# Altium schematic sheet nlf15-main_power.SchDoc
size A4
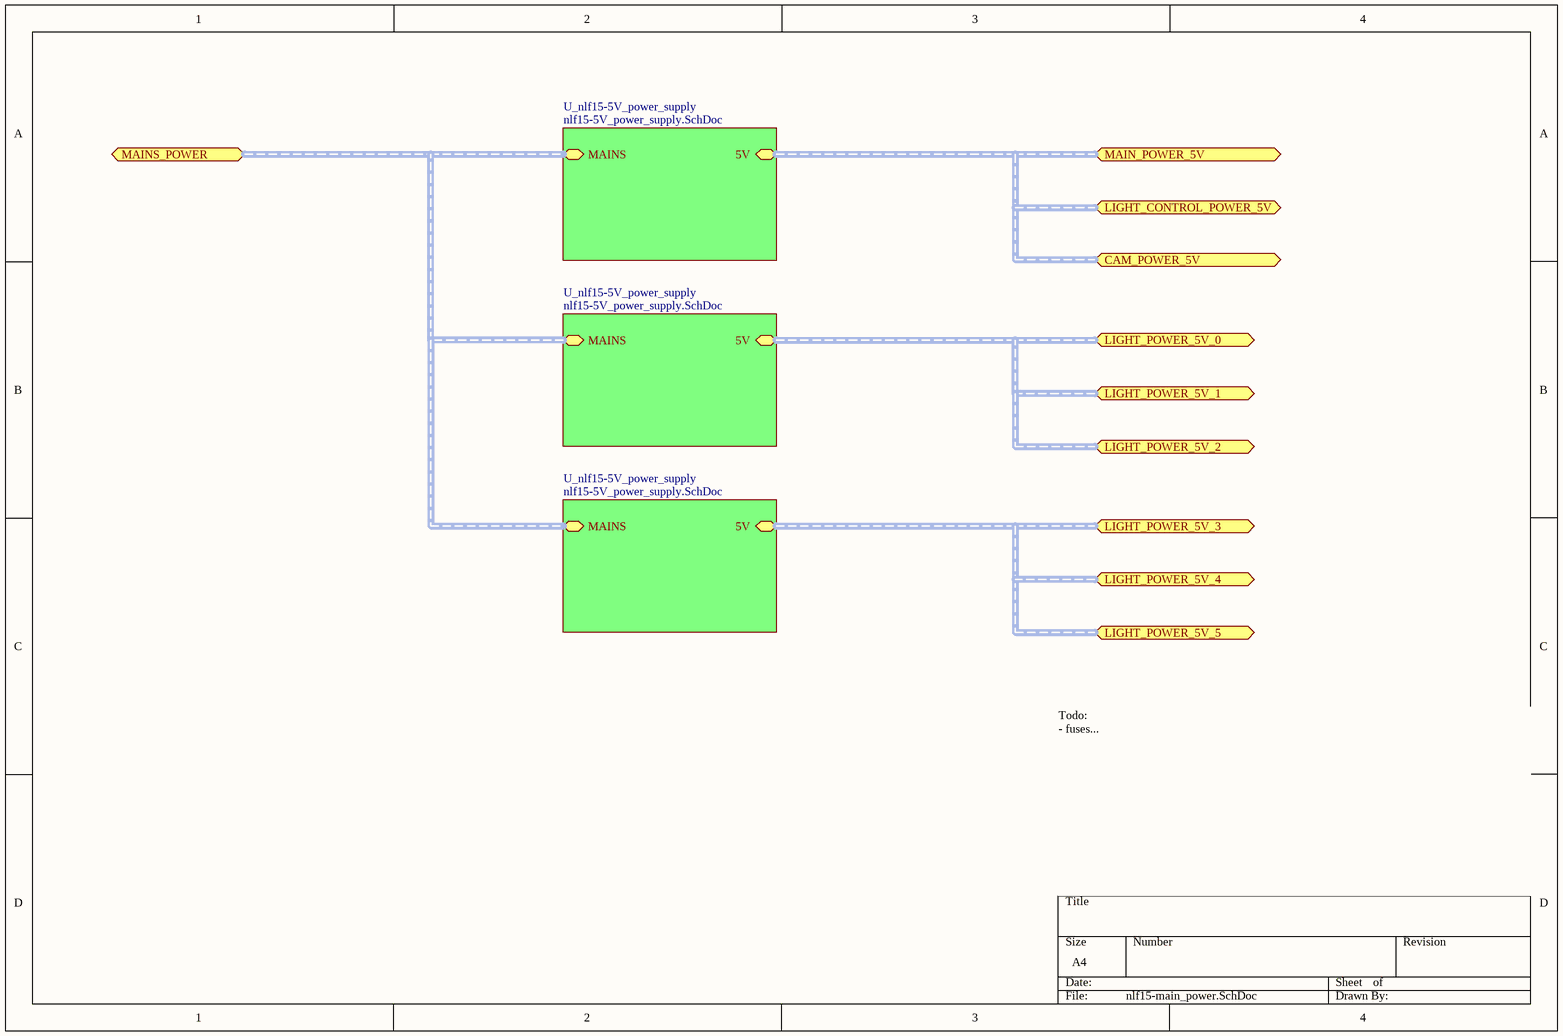
[diagram p0: nlf15-main_power.SchDoc]

## Sub-sheets
U_nlf15-5V_power_supply = nlf15-5V_power_supply.SchDoc: MAINS (harness MAINS-Harness), 5V (harness POWER_5V-Harness)
U_nlf15-5V_power_supply = nlf15-5V_power_supply.SchDoc: MAINS (harness MAINS-Harness), 5V (harness POWER_5V-Harness)
U_nlf15-5V_power_supply = nlf15-5V_power_supply.SchDoc: MAINS (harness MAINS-Harness), 5V (harness POWER_5V-Harness)

## Ports
CAM_POWER_5V (harness POWER_5V-Harness), LIGHT_CONTROL_POWER_5V (harness POWER_5V-Harness), LIGHT_POWER_5V_0 (harness POWER_5V-Harness), LIGHT_POWER_5V_1 (harness POWER_5V-Harness), LIGHT_POWER_5V_2 (harness POWER_5V-Harness), LIGHT_POWER_5V_3 (harness POWER_5V-Harness), LIGHT_POWER_5V_4 (harness POWER_5V-Harness), LIGHT_POWER_5V_5 (harness POWER_5V-Harness), MAIN_POWER_5V (harness POWER_5V-Harness), MAINS_POWER (harness MAINS-Harness)

## Buses and harness runs
harness port CAM_POWER_5V = port LIGHT_CONTROL_POWER_5V = port MAIN_POWER_5V = sheet U_nlf15-5V_power_supply/5V
harness port LIGHT_POWER_5V_0 = port LIGHT_POWER_5V_1 = port LIGHT_POWER_5V_2 = sheet U_nlf15-5V_power_supply/5V
harness port LIGHT_POWER_5V_3 = port LIGHT_POWER_5V_4 = port LIGHT_POWER_5V_5 = sheet U_nlf15-5V_power_supply/5V
harness port MAINS_POWER = sheet U_nlf15-5V_power_supply/MAINS

## Notes on the sheet
- Todo:
  - fuses...